# EasyEDA schematic schematic.json
TITLE: Dual voltage power supply; REV: 1.0; Date: 2021-09-26; Sheet: 1/1; Drawn By: rajashekar ganiger; Company: UTD
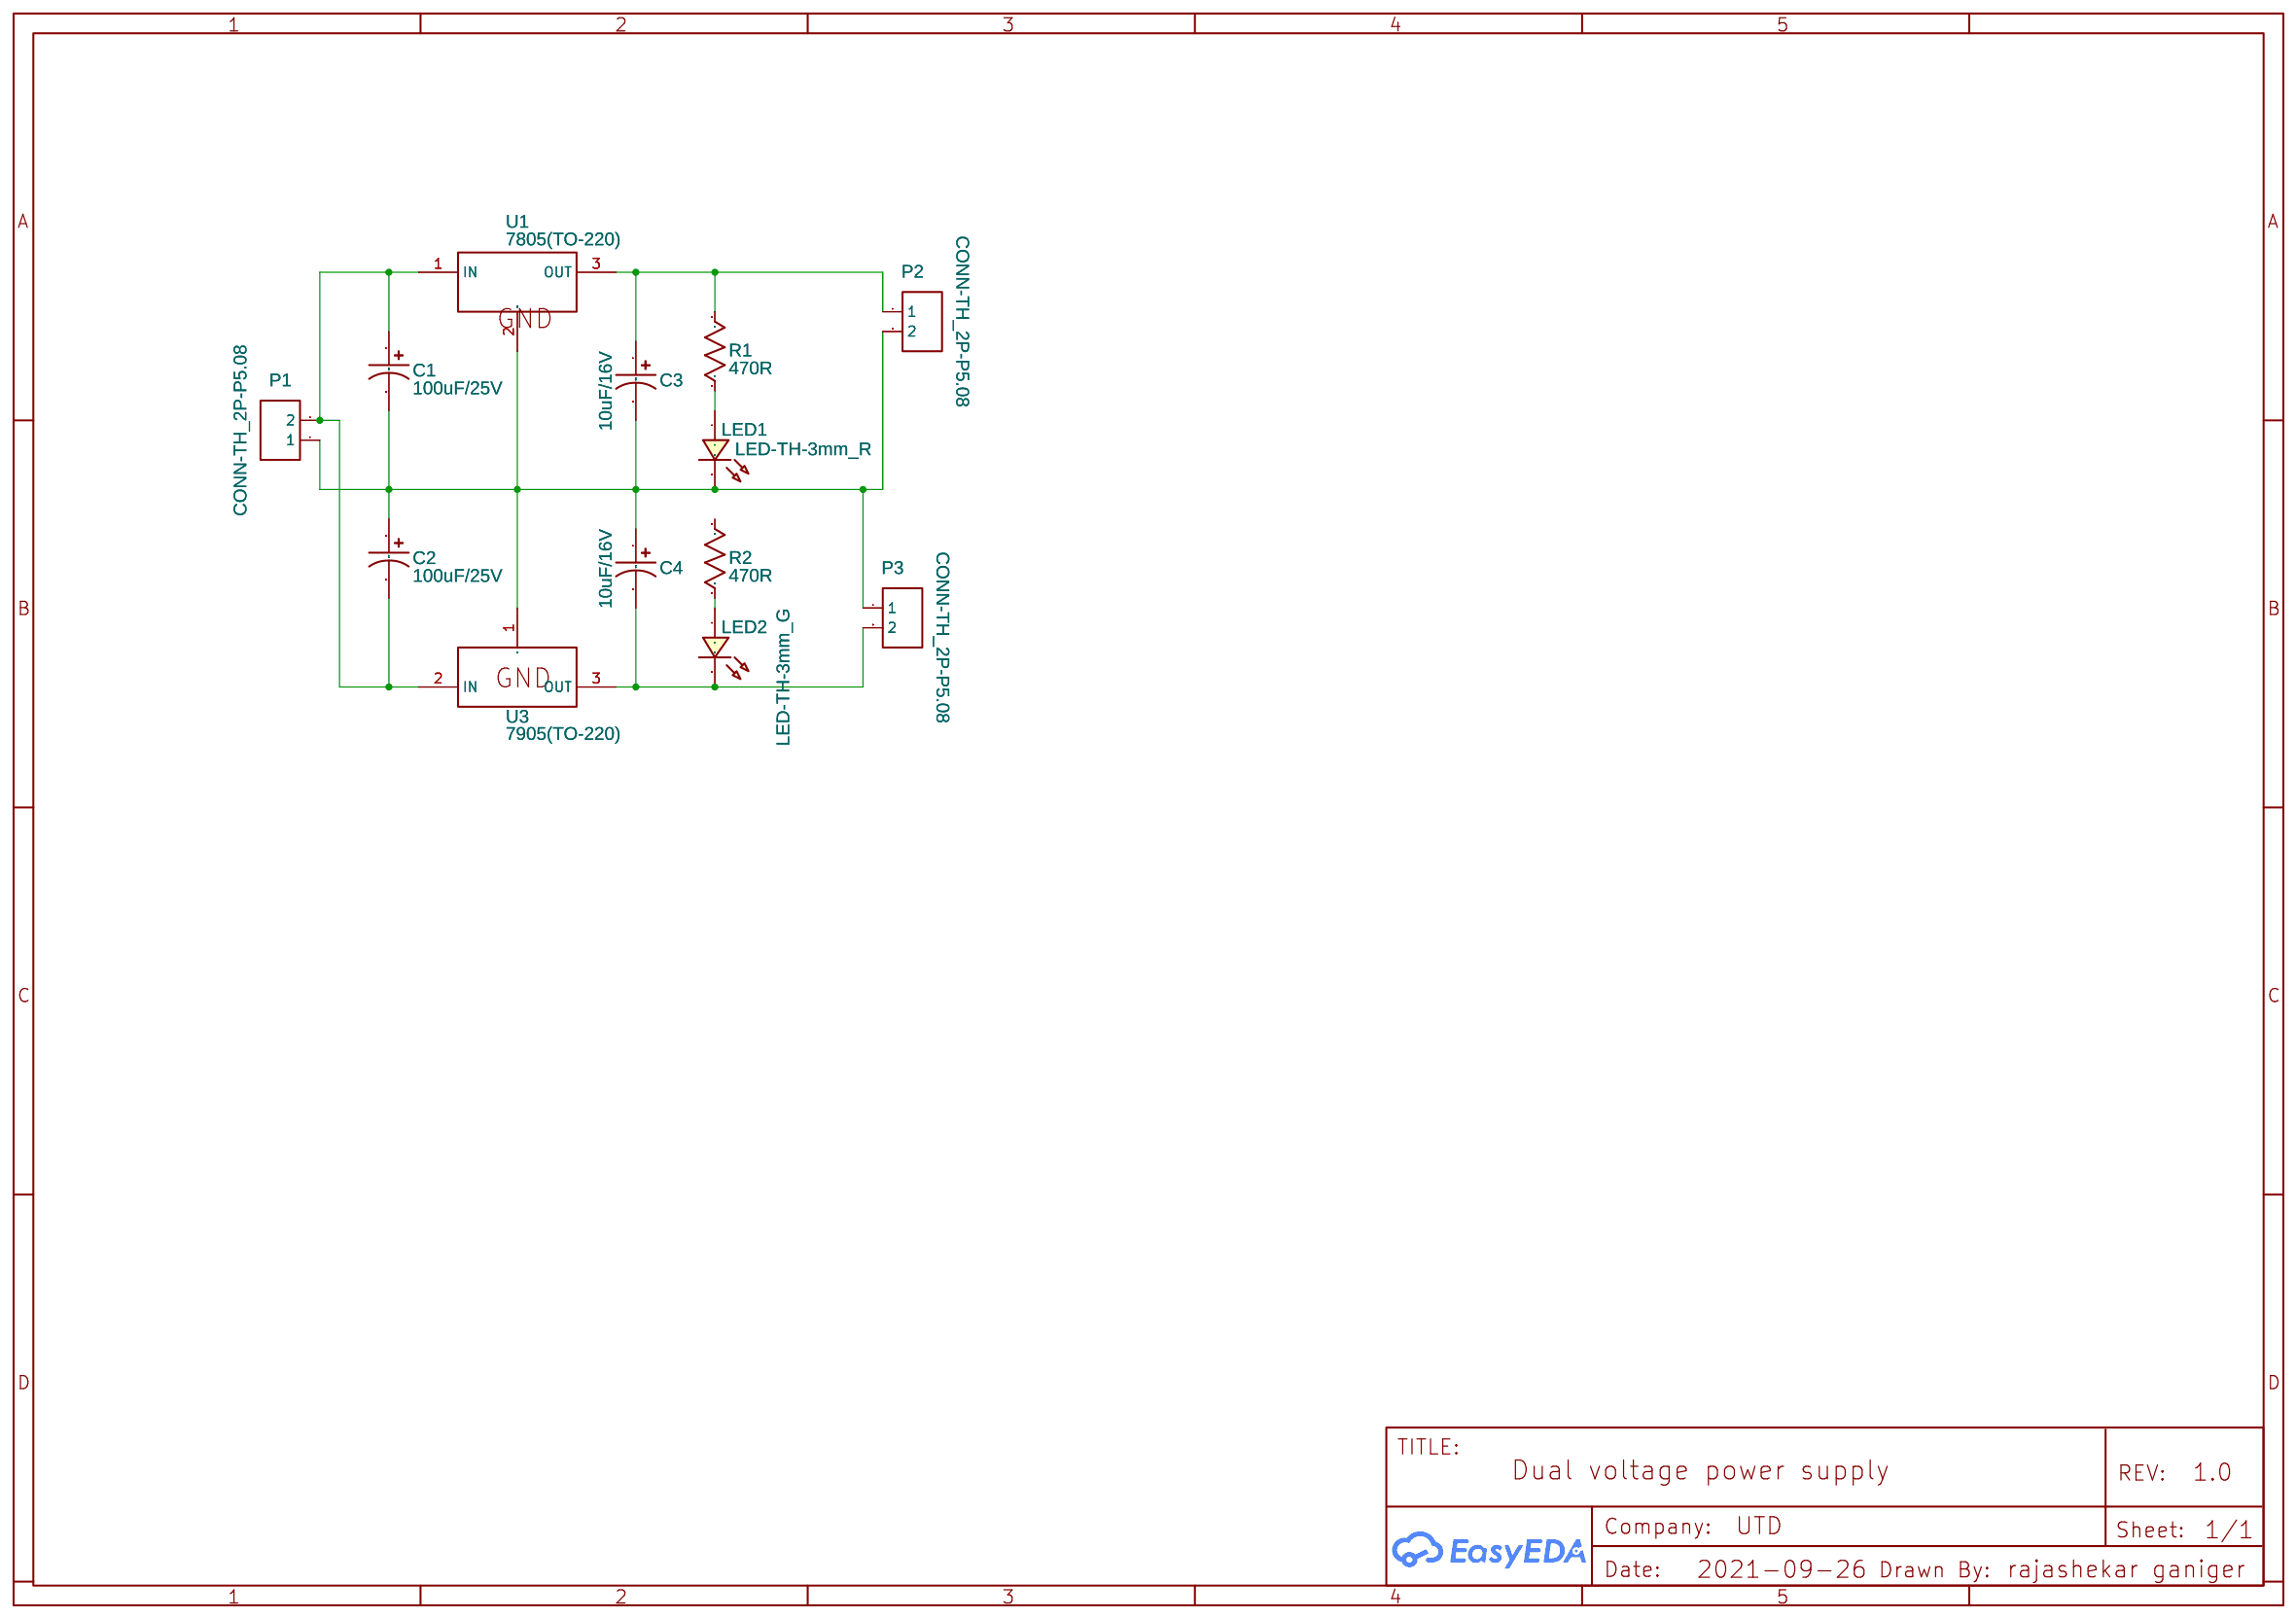
[diagram p0: schematic sheet]

## Parts
C1  100uF/25V  [CAP-D6.3×F2.5]
C2  100uF/25V  [CAP-D6.3×F2.5]
C3  10uF/16V  [CAP-D6.3×F2.5]
C4  10uF/16V  [CAP-D6.3×F2.5]
LED1  LED-TH-3mm_R  [LED-TH_BD3.0_RED]
LED2  LED-TH-3mm_G  [LED-TH_BD3.0_GREEN]
P1  CONN-TH_2P-P5.08  [CONN-TH_2P-P5.08]
P2  CONN-TH_2P-P5.08  [CONN-TH_2P-P5.08]
P3  CONN-TH_2P-P5.08  [CONN-TH_2P-P5.08]
R1  470R  [R_AXIAL-0.3]
R2  470R  [R_AXIAL-0.3]
U1  7805(TO-220)  [TO-220-3_L10.0-W4.5-P2.54-L]
U3  7905(TO-220)  [TO-220-3_L10.0-W4.5-P2.54-L]

## Library data of the parts
C1-C4 = CE_TH_D6.3×F2.5_US: Contributor: LCEDA_Lib
LED1 = LED-TH-3mm_R: Manufacturer: EVERLIGHT(台湾亿光); Manufacturer Part: 204-10SDRD/S530-A3-L; Supplier Part: C84774; Supplier: LCSC; Contributor: LCEDA_Lib
LED2 = LED-TH-3mm_G: Manufacturer: EVERLIGHT(台湾亿光); Manufacturer Part: 204-10SYGD/S530-E3; Supplier Part: C85161; Contributor: LCEDA_Lib
P1-P3 = CONN-TH_2P-P5.08: Supplier: LCSC; Contributor: LCEDA_Lib
R1 R2 = R_AXIAL-0.3_US: Contributor: LCEDA_Lib
U1 = 7805(TO-220): Supplier: LCSC; Manufacturer: STMicroelectronics; Manufacturer Part: L7805CV-DG; Supplier Part: C3795; Contributor: LCEDA_Lib
U3 = 7905(TO-220): Supplier: LCSC; Manufacturer: STMicroelectronics; Manufacturer Part: L7905CV-DG; image: //image.lceda.cn/szlcsc/C3799.jpg; Supplier Part: C3799; Contributor: LCEDA_Lib

## Nets
Net-(C1-1): C1.1 C2.2 P1.2 U1.1(IN) U3.2(IN)
Net-(C1-2): C1.2 C2.1 C3.2 C4.1 LED1.2 P1.1 P2.2 P3.1 U1.2(GND) U3.1(GND)
Net-(C3-1): C3.1 P2.1 R1.2 U1.3(OUT)
Net-(C4-2): C4.2 LED2.2 P3.2 U3.3(OUT)
Net-(LED1-1): LED1.1 R1.1
Net-(LED2-1): LED2.1 R2.1

Not connected (* = marked no-connect by the designer): R2 2
